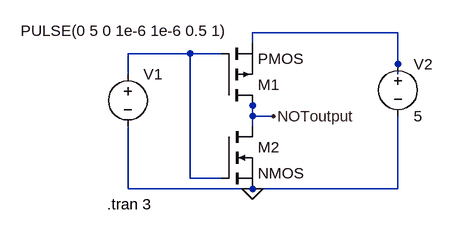
[diagram p0: schematic not.asc]
not.asc, the LTspice schematic file:
Version 4
SHEET 1 2860 680
WIRE -1616 -384 -1840 -384
WIRE -1840 -368 -1840 -384
WIRE -1936 -352 -2032 -352
WIRE -1888 -352 -1936 -352
WIRE -1616 -336 -1616 -384
WIRE -2032 -320 -2032 -352
WIRE -1616 -320 -1616 -336
WIRE -1840 -272 -1840 -288
WIRE -1840 -256 -1840 -272
WIRE -1808 -256 -1840 -256
WIRE -1840 -240 -1840 -256
WIRE -1936 -160 -1936 -352
WIRE -1888 -160 -1936 -160
WIRE -2032 -144 -2032 -240
WIRE -1840 -144 -2032 -144
WIRE -1616 -144 -1616 -256
WIRE -1616 -144 -1840 -144
FLAG -1808 -256 NOToutput
FLAG -1840 -144 0
SYMBOL pmos -1888 -272 M180
SYMATTR InstName M1
SYMBOL nmos -1888 -240 R0
SYMATTR InstName M2
SYMBOL voltage -2032 -336 R0
WINDOW 123 0 0 Left 2
WINDOW 39 0 0 Left 2
WINDOW 3 -165 -51 Left 2
SYMATTR InstName V1
SYMATTR Value PULSE(0 5 0 1e-6 1e-6 0.5 1)
SYMBOL voltage -1616 -352 R0
WINDOW 123 0 0 Left 2
WINDOW 39 0 0 Left 2
SYMATTR InstName V2
SYMATTR Value 5
TEXT -2064 -120 Left 2 !.tran 3

The netlist it stands for:
* not.asc
M1 NOToutput N002 N001 N001 PMOS
M2 NOToutput N002 0 0 NMOS
V1 N002 0 PULSE(0 5 0 1e-6 1e-6 0.5 1)
V2 N001 0 5
.model NMOS NMOS
.model PMOS PMOS
.lib standard.mos
.tran 3
.backanno
.end